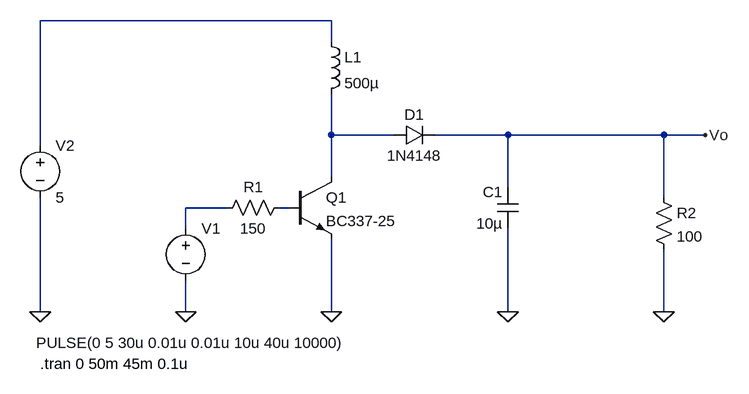
[diagram p0: schematic FuenteConmutada.asc]
FuenteConmutada.asc, the LTspice schematic file:
Version 4
SHEET 1 896 680
WIRE 272 -128 -176 -128
WIRE 272 -96 272 -128
WIRE 272 48 272 -16
WIRE 368 48 272 48
WIRE 544 48 432 48
WIRE 784 48 544 48
WIRE 848 48 784 48
WIRE -176 64 -176 -128
WIRE 272 112 272 48
WIRE 544 128 544 48
WIRE 784 144 784 48
WIRE 112 160 48 160
WIRE 208 160 192 160
WIRE 48 192 48 160
WIRE -176 320 -176 144
WIRE 48 320 48 272
WIRE 272 320 272 208
WIRE 544 320 544 192
WIRE 784 320 784 224
FLAG 48 320 0
FLAG 272 320 0
FLAG 544 320 0
FLAG 784 320 0
FLAG -176 320 0
FLAG 848 48 Vo
SYMBOL npn 208 112 R0
SYMATTR InstName Q1
SYMATTR Value BC337-25
SYMBOL res 208 144 R90
WINDOW 0 0 56 VBottom 2
WINDOW 3 32 56 VTop 2
SYMATTR InstName R1
SYMATTR Value 150
SYMBOL voltage 48 176 R0
WINDOW 3 -230 192 Left 2
WINDOW 123 0 0 Left 0
WINDOW 39 0 0 Left 0
SYMATTR Value PULSE(0 5 30u 0.01u 0.01u 10u 40u 10000)
SYMATTR InstName V1
SYMBOL cap 560 192 R180
WINDOW 0 24 56 Left 2
WINDOW 3 24 8 Left 2
SYMATTR InstName C1
SYMATTR Value 10µ
SYMBOL res 768 128 R0
SYMATTR InstName R2
SYMATTR Value 100
SYMBOL diode 368 64 R270
WINDOW 0 32 32 VTop 2
WINDOW 3 0 32 VBottom 2
SYMATTR InstName D1
SYMATTR Value 1N4148
SYMBOL ind 256 -112 R0
SYMATTR InstName L1
SYMATTR Value 500µ
SYMBOL voltage -176 48 R0
WINDOW 123 0 0 Left 0
WINDOW 39 0 0 Left 0
SYMATTR InstName V2
SYMATTR Value 5
TEXT -176 400 Left 2 !.tran 0 50m 45m 0.1u

The netlist it stands for:
* FuenteConmutada.asc
Q1 N002 N004 0 0 BC337-25
R1 N004 N003 150
V1 N003 0 PULSE(0 5 30u 0.01u 0.01u 10u 40u 10000)
C1 0 Vo 10µ
R2 Vo 0 100
D1 N002 Vo 1N4148
L1 N001 N002 500µ
V2 N001 0 5
.model D D
.lib standard.dio
.model NPN NPN
.model PNP PNP
.lib standard.bjt
.tran 0 50m 45m 0.1u
.backanno
.end